# Altium project TrackerController010.PrjPcb
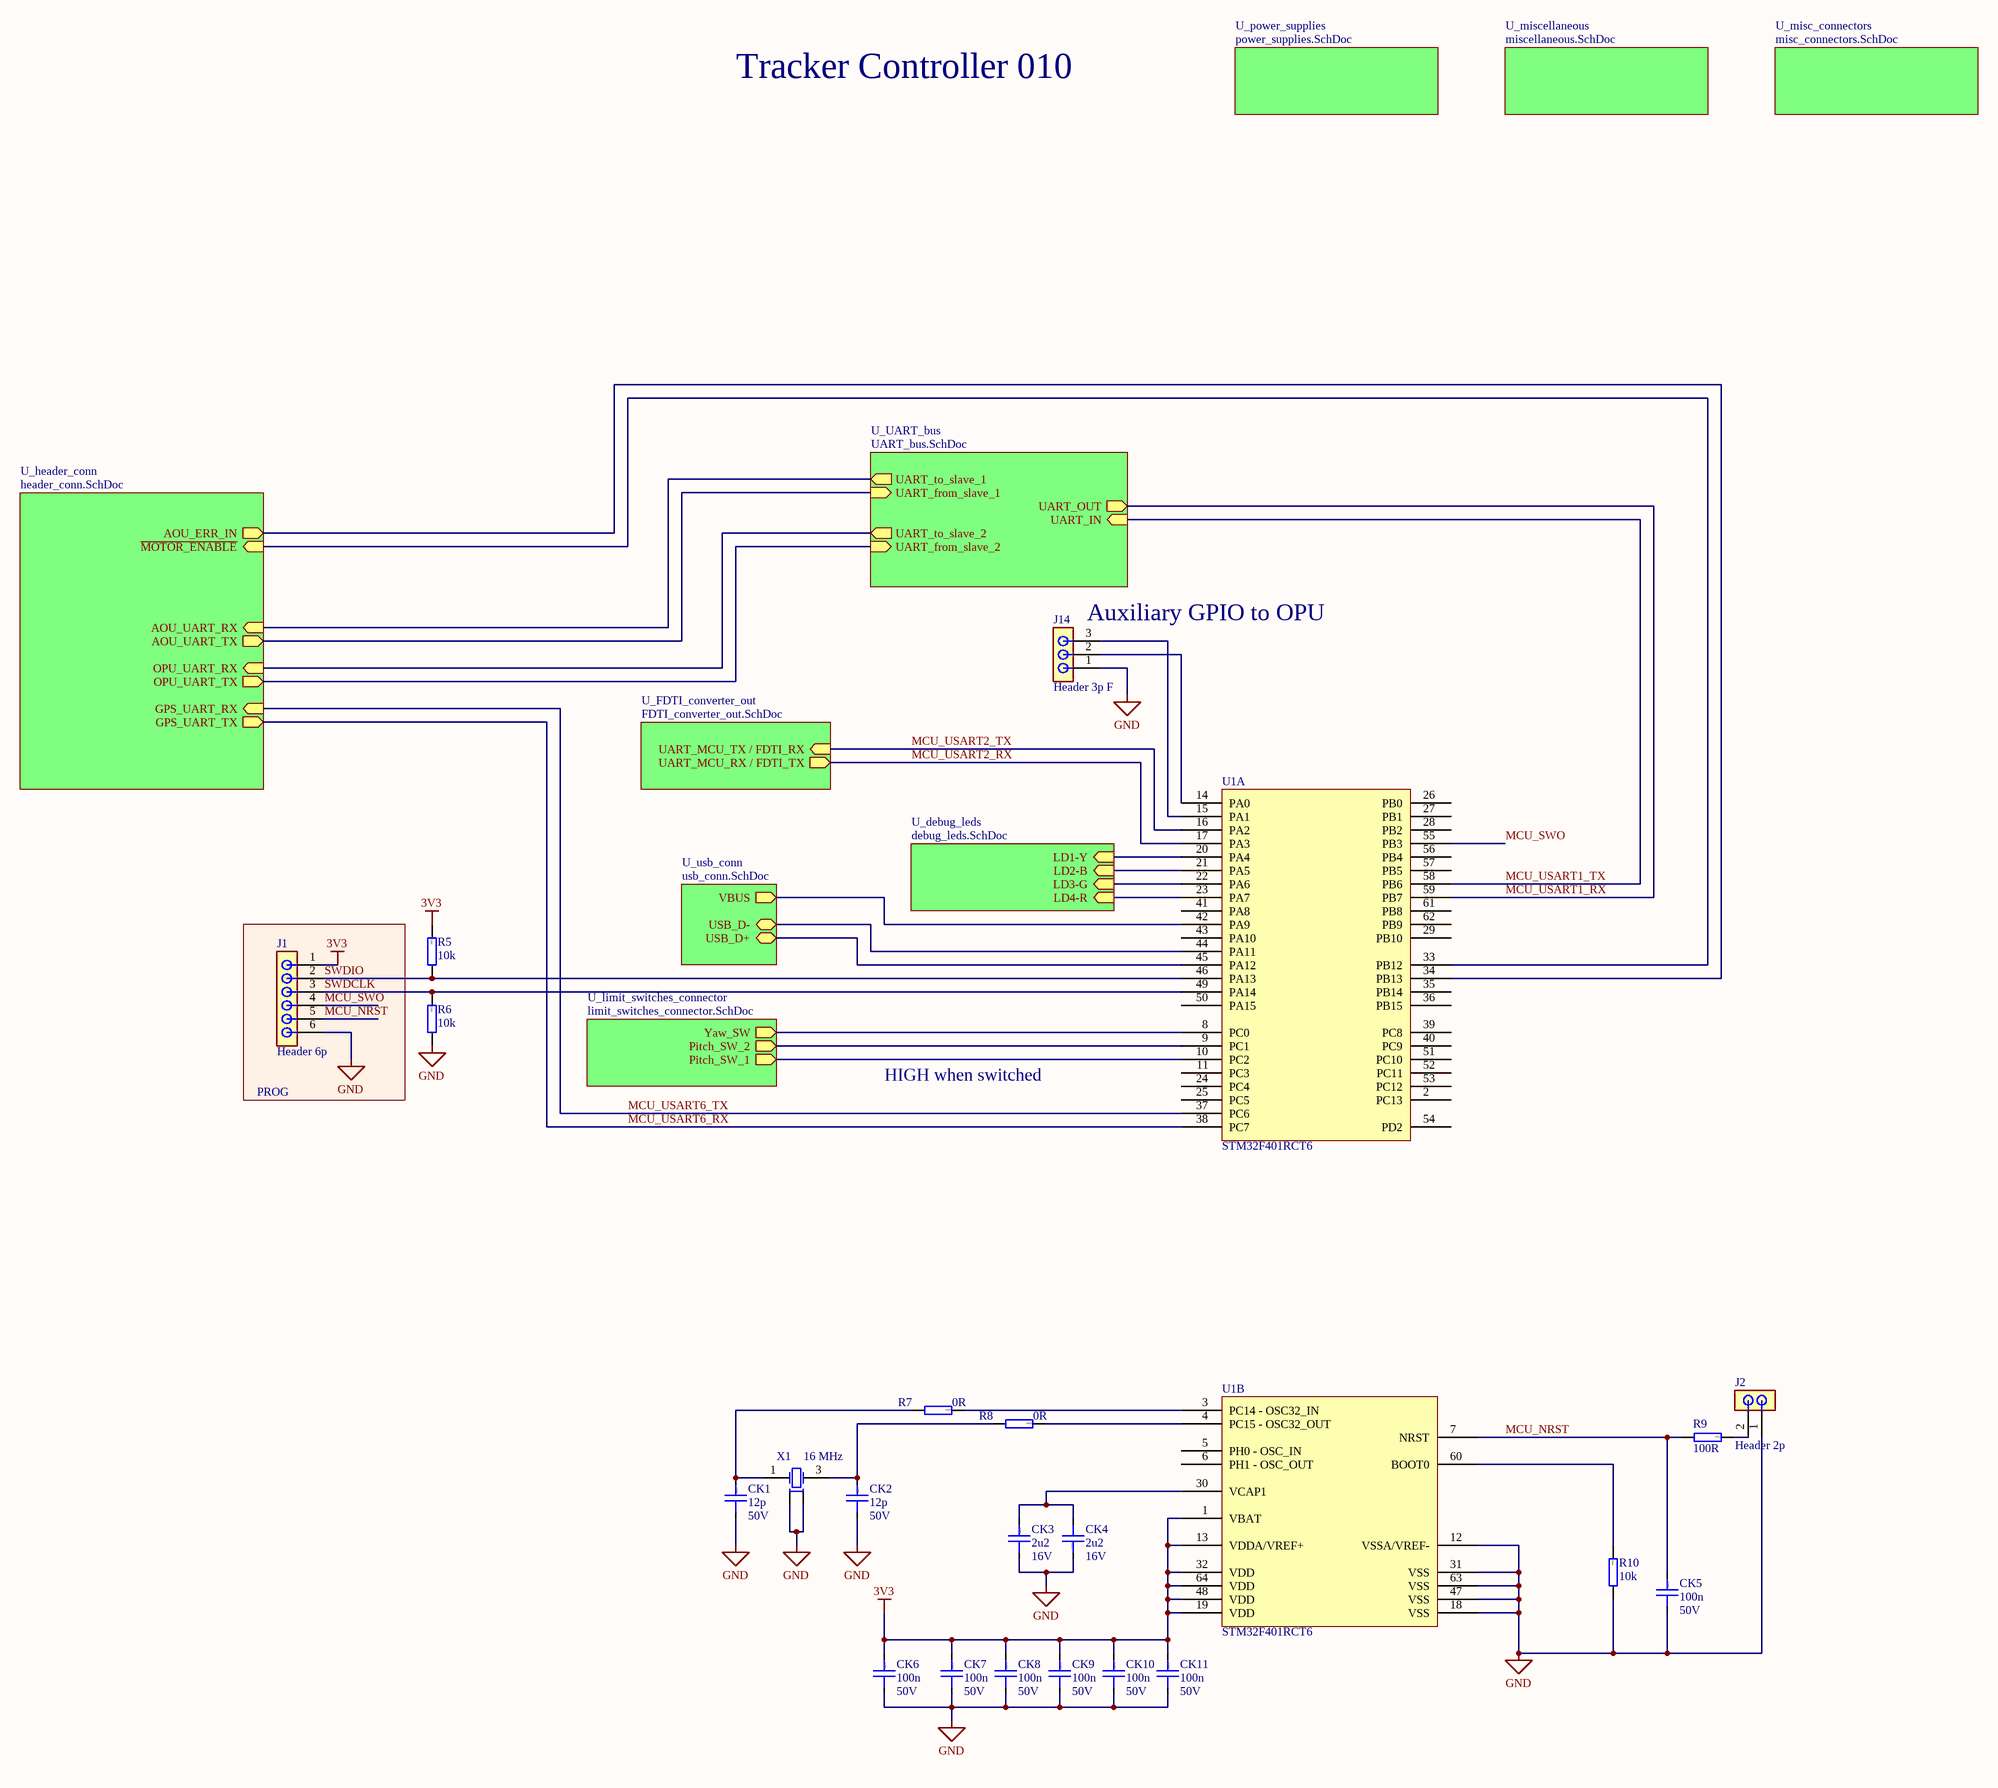
[diagram p0: main.SchDoc]
10 sheets, 125 parts. Net scope: hierarchical (ports join the sheet entries above them; power ports are global).
Board file: TrackerController010.PcbDoc
Sheets:
  main.SchDoc
    U_usb_conn = usb_conn.SchDoc
    U_FDTI_converter_out = FDTI_converter_out.SchDoc
    U_power_supplies = power_supplies.SchDoc
    U_UART_bus = UART_bus.SchDoc
    U_header_conn = header_conn.SchDoc
    U_miscellaneous = miscellaneous.SchDoc
    U_limit_switches_connector = limit_switches_connector.SchDoc
    U_misc_connectors = misc_connectors.SchDoc
    U_debug_leds = debug_leds.SchDoc

## Sheet main.SchDoc
size A2; SheetNumber: 1; SheetTotal: 10

### Parts
CK1  12p  Voltage rating: 50V  [CAP0603]
CK2  12p  Voltage rating: 50V  [CAP0603]
CK3  2u2  Voltage rating: 16V  [CAP0603]
CK4  2u2  Voltage rating: 16V  [CAP0603]
CK5  100n  Voltage rating: 50V  [CAP0603]
CK6  100n  Voltage rating: 50V  [CAP0603]
CK7  100n  Voltage rating: 50V  [CAP0603]
CK8  100n  Voltage rating: 50V  [CAP0603]
CK9  100n  Voltage rating: 50V  [CAP0603]
CK10  100n  Voltage rating: 50V  [CAP0603]
CK11  100n  Voltage rating: 50V  [CAP0603]
J1  Header 6p  [Pin header 6p]
J2  Header 2p  [Pin header 2p]
J14  Header 3p F  [Pin header 3p - F]
R5  10k  [RESC2012X06N(SMR0805)]
R6  10k  [RESC2012X06N(SMR0805)]
R7  0R  [RESC2012X06N(SMR0805)]
R8  0R  [RESC2012X06N(SMR0805)]
R9  100R  [RESC2012X06N(SMR0805)]
R10  10k  [RESC2012X06N(SMR0805)]
U1  STM32F401RCT6  [LQFP64]  (parts A,B of 2)
X1  16 MHz  [3225 XTal]

### Blocks framed on the sheet
PROG: J1

### Sub-sheets
U_debug_leds = debug_leds.SchDoc: LD4-R (in), LD3-G (in), LD2-B (in), LD1-Y (in)
U_FDTI_converter_out = FDTI_converter_out.SchDoc: UART_MCU_TX / FDTI_RX (in), UART_MCU_RX / FDTI_TX (out)
U_header_conn = header_conn.SchDoc: ~{MOTOR_ENABLE} (in), AOU_ERR_IN (out), AOU_UART_RX (in), AOU_UART_TX (out), GPS_UART_RX (in), GPS_UART_TX (out), OPU_UART_RX (in), OPU_UART_TX (out)
U_limit_switches_connector = limit_switches_connector.SchDoc: Pitch_SW_1 (out), Yaw_SW (out), Pitch_SW_2 (out)
U_misc_connectors = misc_connectors.SchDoc: no entries
U_miscellaneous = miscellaneous.SchDoc: no entries
U_power_supplies = power_supplies.SchDoc: no entries
U_UART_bus = UART_bus.SchDoc: UART_IN (in), UART_OUT (out), UART_to_slave_1 (out), UART_from_slave_1 (in), UART_to_slave_2 (out), UART_from_slave_2 (in)
U_usb_conn = usb_conn.SchDoc: VBUS (out), USB_D- (bidir), USB_D+ (bidir)

### Nets
3V3: CK6.1 CK7.1 CK8.1 CK9.1 CK10.1 CK11.1 J1.1 R5.2 U1.1(VBAT) U1.13(VDDA/VREF+) U1.19(VDD) U1.32(VDD) U1.48(VDD) U1.64(VDD)
GND: CK1.2 CK2.2 CK3.2 CK4.1 CK5.2 CK6.2 CK7.2 CK8.2 CK9.2 CK10.2 CK11.2 J1.6 J2.1 J14.1 R6.1 R10.1 U1.12(VSSA/VREF-) U1.18(VSS) U1.31(VSS) U1.47(VSS) U1.63(VSS) X1.2 X1.4
MCU_NRST: CK5.1 J1.5 R9.1 U1.7(NRST)
MCU_SWO: J1.4 U1.55(PB3)
MCU_USART1_RX: U1.59(PB7) ; sheet U_UART_bus/UART_OUT
MCU_USART1_TX: U1.58(PB6) ; sheet U_UART_bus/UART_IN
MCU_USART2_RX: U1.17(PA3) ; sheet U_FDTI_converter_out/UART_MCU_RX / FDTI_TX
MCU_USART2_TX: U1.16(PA2) ; sheet U_FDTI_converter_out/UART_MCU_TX / FDTI_RX
MCU_USART6_RX: U1.38(PC7) ; sheet U_header_conn/GPS_UART_TX  [project net GPS_UART_TX]
MCU_USART6_TX: U1.37(PC6) ; sheet U_header_conn/GPS_UART_RX  [project net GPS_UART_RX]
OPU_UART_RX: sheet U_UART_bus/UART_to_slave_2, sheet U_header_conn/OPU_UART_RX
OPU_UART_TX: sheet U_UART_bus/UART_from_slave_2, sheet U_header_conn/OPU_UART_TX
SWDCLK: J1.3 R6.2 U1.49(PA14)
SWDIO: J1.2 R5.1 U1.46(PA13)
NetCK1_1: CK1.1 R7.1 X1.1
NetCK2_1: CK2.1 R8.1 X1.3
NetCK3_1: CK3.1 CK4.2 U1.30(VCAP1)
NetCK30_1: U1.10(PC2) ; sheet U_limit_switches_connector/Pitch_SW_1
NetCK31_1: U1.9(PC1) ; sheet U_limit_switches_connector/Pitch_SW_2
NetCK32_1: U1.8(PC0) ; sheet U_limit_switches_connector/Yaw_SW
NetJ2_2: J2.2 R9.2
NetJ14_2: J14.2 U1.14(PA0)
NetJ14_3: J14.3 U1.15(PA1)
NetR1_1: U1.20(PA4) ; sheet U_debug_leds/LD1-Y
NetR2_1: U1.21(PA5) ; sheet U_debug_leds/LD2-B
NetR3_1: U1.22(PA6) ; sheet U_debug_leds/LD3-G
NetR4_1: U1.23(PA7) ; sheet U_debug_leds/LD4-R
NetR7_2: R7.2 U1.3(PC14_-_OSC32_IN)
NetR8_2: R8.2 U1.4(PC15_-_OSC32_OUT)
NetR10_2: R10.2 U1.60(BOOT0)
NetR11_1: U1.42(PA9) ; sheet U_usb_conn/VBUS
NetR13_2: U1.44(PA11) ; sheet U_usb_conn/USB_D-
NetR14_2: U1.45(PA12) ; sheet U_usb_conn/USB_D+
NetR27_2: sheet U_UART_bus/UART_to_slave_1, sheet U_header_conn/AOU_UART_RX
NetR29_2: U1.33(PB12) ; sheet U_header_conn/~{MOTOR_ENABLE}
NetR30_2: U1.34(PB13) ; sheet U_header_conn/AOU_ERR_IN
NetR32_2: sheet U_UART_bus/UART_from_slave_1, sheet U_header_conn/AOU_UART_TX

Not connected (* = marked no-connect by the designer): U1 2(PC13) 5(PH0_-_OSC_IN) 6(PH1_-_OSC_OUT) 11(PC3) 24(PC4) 25(PC5) 26(PB0) 27(PB1) 28(PB2) 29(PB10) 35(PB14) 36(PB15) 39(PC8) 40(PC9) 41(PA8) 43(PA10) 50(PA15) 51(PC10) 52(PC11) 53(PC12) 54(PD2) 56(PB4) 57(PB5) 61(PB8) 62(PB9)

### Notes on the sheet
- Tracker Controller 010
- (near J14) Auxiliary GPIO to OPU
- HIGH when switched
- (in symbol Cap 2u2 0603) 0603
- (in symbol Cap 12p 0603) 0603
- (in symbol Cap 100n 0603) 0603

### Library data of the parts
CK1 CK2 = Cap 12p 0603: 50V 12pF C0G ±5% 0603 Multilayer Ceramic Capacitors MLCC - SMD/SMT ROHS; Basic: Yes; Value: 12p; JLCPCB Part: C38523
CK3 CK4 = Cap 2u2 0603: 16V 2.2uF X5R ±10% 0603 Multilayer Ceramic Capacitors MLCC - SMD/SMT ROHS; Basic: Yes; Value: 2u2; JLCPCB Part: C23630
CK5-CK11 = Cap 100n 0603: 50V 100nF X7R ±10% 0603 Multilayer Ceramic Capacitors MLCC - SMD/SMT ROHS; Basic: Yes; Value: 100n; JLCPCB Part: C14663
J1 = Pin header 6p: 3A Direct Insert Policy 6P -40℃~+105℃ 2.54mm Single Row Black Brass 1x6P Plugin,P=2.54mm Pin Headers ROHS; Manufacturer_Name: Connfly; Manufacturer_Part_Number: DS1021-1*2SF11-B; Datasheet Link: https://www.tme.com/Document/cc301e58a5da78cb543a94b5a5b7f06a/DS1021.pdf; Height: 5.88mm; JLCPCB Part: C37208
J2 = Pin header 2p: Connector; Manufacturer_Name: Connfly; Manufacturer_Part_Number: DS1021-1*2SF11-B; Basic: No; Datasheet Link: https://www.tme.com/Document/cc301e58a5da78cb543a94b5a5b7f06a/DS1021.pdf; Height: 5.88mm; JLCPCB Part: C492401
J14 = Pin header 3p_F: Direct Insert 2.54mm Policy 3A 2.5mm -40℃~+105℃ 3mm 6mm 250V Black 1x3P Single Row 3P Pin Headers; Manufacturer_Name: Connfly; Manufacturer_Part_Number: DS1021-1*2SF11-B; Basic: No; Datasheet Link: https://www.tme.com/Document/cc301e58a5da78cb543a94b5a5b7f06a/DS1021.pdf; Height: 5.88mm
R5 R6 R10 = Res 10k 0805: 125mW Thick Film Resistors 150V ±100ppm/℃ ±1% 10kΩ 0805 Chip Resistor - Surface Mount ROHS; Tolerance & Rating: 1%/0.1W; Basic: Yes; Value: 10k; Package: 0805; SMD: 1; ComponentLink3Description: rezistor čip; ComponentLink3URL: heliosgreen://v1/hegMT/5-MT/Classes(343)/Folders/OpenForm?RecordNumbers=[381513]; JLCPCB Part: C17414
R7 R8 = Res 0R 0805: 125mW Thick Film Resistors 150V ±800ppm/℃ ±1% 0Ω 0805 Chip Resistor - Surface Mount ROHS; Tolerance & Rating: 1%/0.1W; Basic: YES; Value: 0R; Package: 0805; Author: JP/27.03.2014; SMD: 1; ComponentLink3Description: rezistor čip; ComponentLink3URL: heliosgreen://v1/hegMT/5-MT/Classes(343)/Folders/OpenForm?RecordNumbers=[381513]; JLCPCB Part: C17477
R9 = Res 100R 0805: 125mW Thick Film Resistors 150V ±100ppm/℃ ±1% 100Ω 0805 Chip Resistor - Surface Mount ROHS; Tolerance & Rating: 1%/0.1W; Basic: Yes; Value: 100R; Package: 0805; Author: JP/27.03.2014; SMD: 1; ComponentLink3Description: rezistor čip; ComponentLink3URL: heliosgreen://v1/hegMT/5-MT/Classes(343)/Folders/OpenForm?RecordNumbers=[381513]; JLCPCB Part: C17408
U1 = STM32F401RCT6: 256KB 1.7V~3.6V ARM-M4 64KB 84MHz FLASH 50 LQFP-64(10x10) Microcontrollers (MCU/MPU/SOC) ROHS; Basic: No; JLCPCB Part: C74524
X1 = 16 MHz crystal: X322516MLB4SI / 16MHz Surface Mount Crystal 9pF ±10ppm ±20ppm SMD3225-4P Crystals ROHS; Basic: Yes; JLCPCB: C13738

## Sheet usb_conn.SchDoc
size A4; SheetNumber: 2; SheetTotal: 10
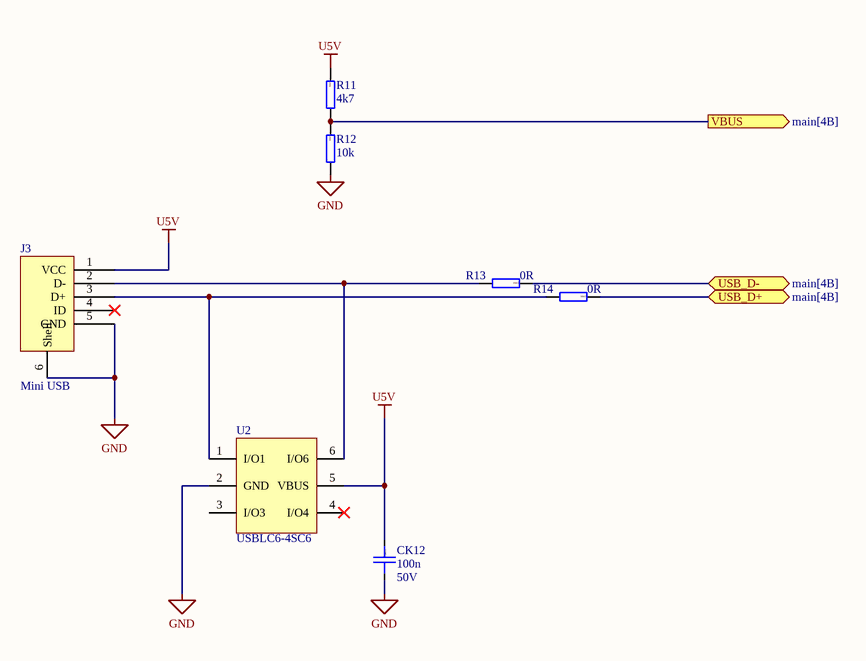
[diagram p1: usb_conn.SchDoc]

### Parts
CK12  100n  Voltage rating: 50V  [CAP0603]
J3  Mini USB  [USB B Mini horizontal]
R11  4k7  [RESC2012X06N(SMR0805)]
R12  10k  [RESC2012X06N(SMR0805)]
R13  0R  [RESC2012X06N(SMR0805)]
R14  0R  [RESC2012X06N(SMR0805)]
U2  USBLC6-4SC6  [SOT23-6]

### Ports
USB_D+ (bidir, see main[4B]), USB_D- (bidir, see main[4B]), VBUS (out, see main[4B])

### Nets
GND: CK12.2 J3.5(GND) J3.6(Shell) R12.1 U2.2(GND)
U5V: CK12.1 J3.1(VCC) R11.2 U2.5(VBUS)
NetJ3_2: J3.2(D-) R13.1 U2.6(I/O6)
NetJ3_3: J3.3(D+) R14.1 U2.1(I/O1)
NetR11_1: R11.1 R12.2 ; port VBUS
NetR13_2: R13.2 ; port USB_D-
NetR14_2: R14.2 ; port USB_D+

Not connected (* = marked no-connect by the designer): J3 4(ID)*; U2 3(I/O3) 4(I/O4)*

### Notes on the sheet
- (in symbol Cap 100n 0603) 0603

### Library data of the parts
CK12 = Cap 100n 0603: as CK5 on sheet main; Value: 100n; JLCPCB Part: C14663
J3 = Mini USB: Konektor: USB B mini; zásuvka; na PCB; SMT; PIN: 5; vodorovné; TME Part: MX-67503-1020
R11 = Res 4k7 0805: 125mW Thick Film Resistors 150V ±100ppm/℃ ±1% 4.7kΩ 0805 Chip Resistor - Surface Mount ROHS; Tolerance & Rating: 1%/0.1W; Basic: YES; Value: 4k7; Package: 0805; Author: JP/27.03.2014; SMD: 1; ComponentLink3Description: rezistor čip; ComponentLink3URL: heliosgreen://v1/hegMT/5-MT/Classes(343)/Folders/OpenForm?RecordNumbers=[381513]; JLCPCB Part: C17673
R12 = Res 10k 0805: as R5 on sheet main; Value: 10k; Package: 0805; SMD: 1; ComponentLink3Description: rezistor čip; ComponentLink3URL: heliosgreen://v1/hegMT/5-MT/Classes(343)/Folders/OpenForm?RecordNumbers=[381513]; JLCPCB Part: C17414
R13 R14 = Res 0R 0805: as R7 on sheet main; Value: 0R; Package: 0805; Author: JP/27.03.2014; SMD: 1; ComponentLink3Description: rezistor čip; ComponentLink3URL: heliosgreen://v1/hegMT/5-MT/Classes(343)/Folders/OpenForm?RecordNumbers=[381513]; JLCPCB Part: C17477
U2 = USBLC6-4SC6: 5A 17V 6V Unidirectional 5.25V SOT-23-6 ESD and Surge Protection (TVS/ESD) ROHS; Basic: No; JLCPCB Part: C111212; TME Part: USBLC6-4SC6

## Sheet FDTI_converter_out.SchDoc
size A4; SheetNumber: 3; SheetTotal: 10
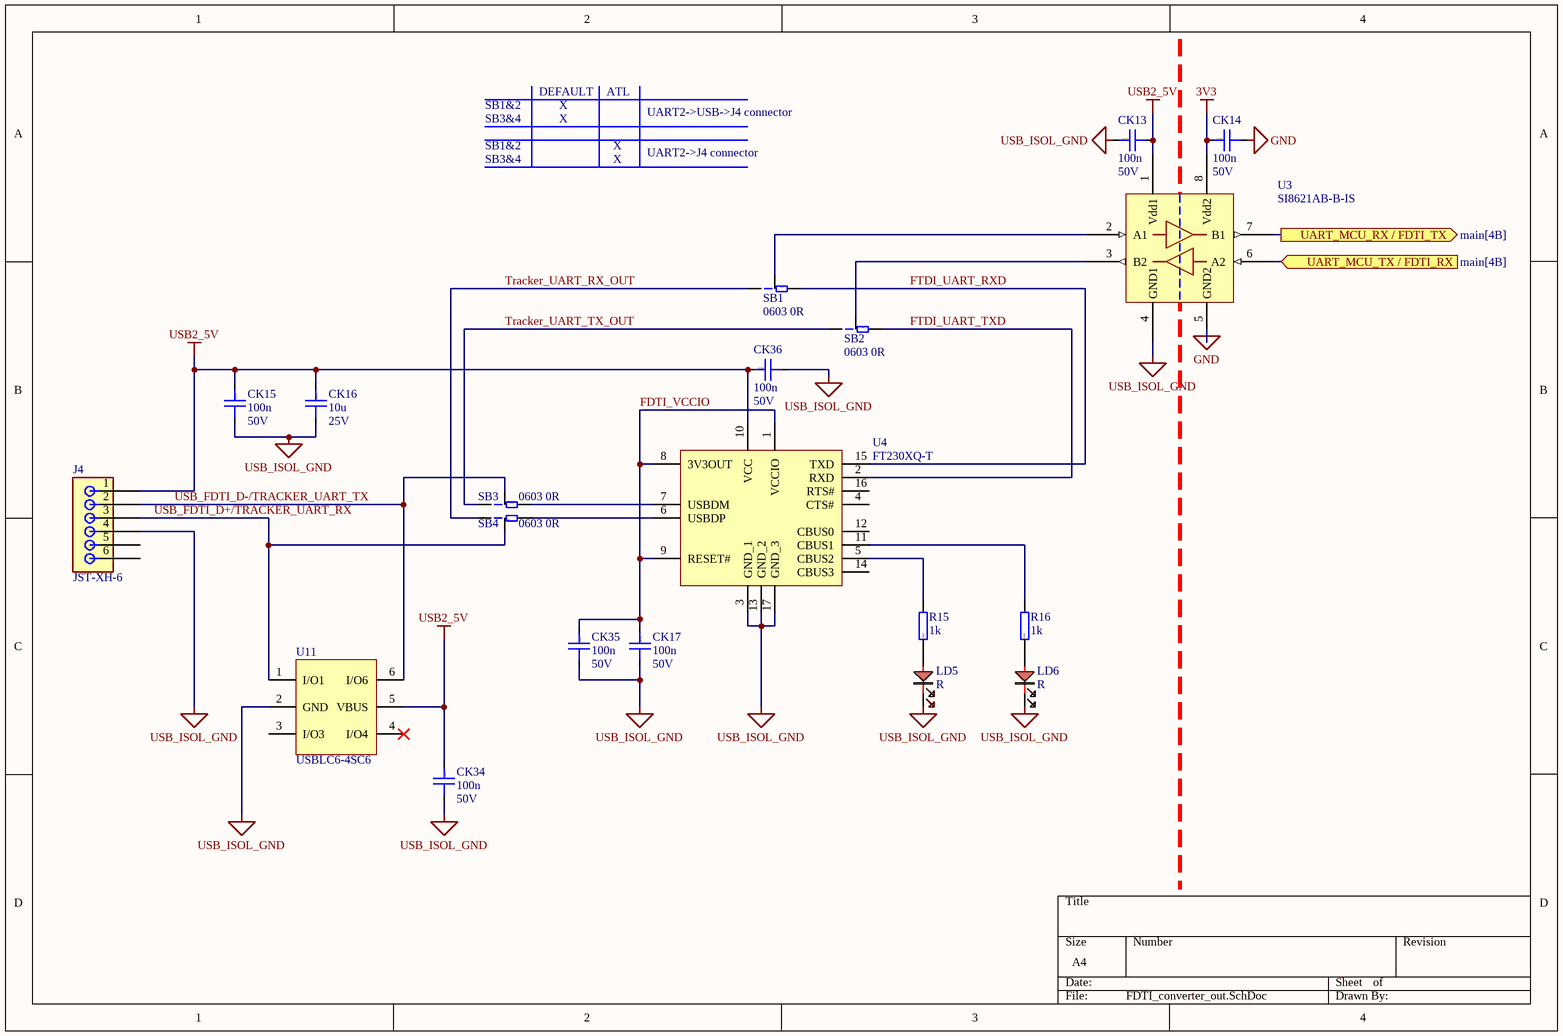
[diagram p2: FDTI_converter_out.SchDoc]

### Parts
CK13  100n  Voltage rating: 50V  [CAP0603]
CK14  100n  Voltage rating: 50V  [CAP0603]
CK15  100n  Voltage rating: 50V  [CAP0603]
CK16  10u  Voltage rating: 25V  [CAP0805]
CK17  100n  Voltage rating: 50V  [CAP0603]
CK34  100n  Voltage rating: 50V  [CAP0603]
CK35  100n  Voltage rating: 50V  [CAP0603]
CK36  100n  Voltage rating: 50V  [CAP0603]
J4  JST-XH-6  [JST-XH-6]
LD5  R  [0603_LED_R]
LD6  R  [0603_LED_R]
R15  1k  [RESC2012X06N(SMR0805)]
R16  1k  [RESC2012X06N(SMR0805)]
SB1  0603 0R  [Solder T bridge 0603]
SB2  0603 0R  [Solder T bridge 0603]
SB3  0603 0R  [Solder T bridge 0603]
SB4  0603 0R  [Solder T bridge 0603]
U3  SI8621AB-B-IS  [SOIC8]
U4  FT230XQ-T  [QFN65P400X400X80-17N]
U11  USBLC6-4SC6  [SOT23-6]

### Ports
UART_MCU_RX / FDTI_TX (out, see main[4B]), UART_MCU_TX / FDTI_RX (in, see main[4B])

### Nets
3V3: CK14.1 U3.8(Vdd2)
GND: CK14.2 U3.5(GND2)
USB2_5V: CK13.2 CK15.1 CK16.1 CK34.1 CK36.1 J4.1 U3.1(Vdd1) U4.10(VCC) U11.5(VBUS)
USB_ISOL_GND: CK13.1 CK15.2 CK16.2 CK17.2 CK34.2 CK35.2 CK36.2 J4.4 LD5.2 LD6.2 U3.4(GND1) U4.3(GND_1) U4.13(GND_2) U4.17(GND_3) U11.2(GND)
FDTI_VCCIO: CK17.1 CK35.1 U4.1(VCCIO) U4.8(3V3OUT) U4.9(RESET#)
FTDI_UART_RXD: SB1.3 U4.15(TXD)
FTDI_UART_TXD: SB2.3 U4.2(RXD)
MCU_USART2_RX: U3.7(B1) ; port UART_MCU_RX / FDTI_TX
MCU_USART2_TX: U3.6(A2) ; port UART_MCU_TX / FDTI_RX
Tracker_UART_RX_OUT: SB1.1 SB4.1
Tracker_UART_TX_OUT: SB2.1 SB3.1
USB_FDTI_D+/TRACKER_UART_RX: J4.3 SB4.2 U11.1(I/O1)
USB_FDTI_D-/TRACKER_UART_TX: J4.2 SB3.2 U11.6(I/O6)
NetLD5_1: LD5.1 R15.2
NetLD6_1: LD6.1 R16.2
NetR15_1: R15.1 U4.5(CBUS2)
NetR16_1: R16.1 U4.11(CBUS1)
NetSB1_2: SB1.2 U3.2(A1)
NetSB2_2: SB2.2 U3.3(B2)
NetSB3_3: SB3.3 U4.7(USBDM)
NetSB4_3: SB4.3 U4.6(USBDP)

Not connected (* = marked no-connect by the designer): J4 5 6; U4 4(CTS#) 12(CBUS0) 14(CBUS3) 16(RTS#); U11 3(I/O3) 4(I/O4)*

### Notes on the sheet
- SB1&2
- DEFAULT
- X
- ATL
- UART2->USB->J4 connector
- SB3&4
- UART2->J4 connector
- (in symbol 0R T-junction) 0R
- (in symbol Cap 10u 0805) 0805
- (in symbol Cap 100n 50V 0603) 0603
- (in symbol Cap 100n 0603) 0603

### Library data of the parts
CK13-CK15 CK17 CK35 CK36 = Cap 100n 50V 0603: 50V 100nF X7R ±10% 0603 Multilayer Ceramic Capacitors MLCC - SMD/SMT ROHS; Basic: Yes; Value: 100n; JLCPCB Part: C14663
CK16 = Cap 10u 0805: 25V 10uF X5R ±10% 0805 Multilayer Ceramic Capacitors MLCC - SMD/SMT ROHS; Basic: Yes; JLCPCB Part: C15850; Value: 10u
CK34 = Cap 100n 0603: as CK5 on sheet main; Value: 100n; JLCPCB Part: C14663
J4 = JST-HX-6: 1x6P 6P XH Tin 6 -25℃~+85℃ 3A 1 2.5mm Brass Bend insert Push-Pull,P=2.5mm Wire To Board Connector ROHS; S6B-XH-A(LF)(SN); Basic: No; JLCPCB Part: C157919; TME Part: S6B-XH-A
LD5 LD6 = LED R 0603: -40℃~+85℃ Red 0603 LED Indication - Discrete ROHS; JLCPCB Part: C2286
R15 R16 = Res 1k 0805: 125mW Thick Film Resistors 150V ±100ppm/℃ ±1% 1kΩ 0805 Chip Resistor - Surface Mount ROHS; Tolerance & Rating: 1%/0.1W; Basic: Yes; Value: 1k; Package: 0805; Author: JP/27.03.2014; SMD: 1; ComponentLink3Description: rezistor čip; ComponentLink3URL: heliosgreen://v1/hegMT/5-MT/Classes(343)/Folders/OpenForm?RecordNumbers=[381513]; JLCPCB Part: C17513
SB1-SB4 = 0R T-junction: Basic: Yes; JLCPCB Part: C21189
U3 = SI8621AB-B-IS: SOIC-8 Digital Isolators ROHS; Basic: No; JLCPCB Part: C430265; TME Part: SI8621AB-B-IS
U4 = FT230XQ-T: Integrated Circuit; Manufacturer_Name: FTDI Chip; Basic: No; Datasheet Link: https://www.ftdichip.com/Support/Documents/DataSheets/ICs/DS_FT230X.pdf; Height: 0.8mm; Manufacturer_Part_Number: FT230XQ-T; Mouser Part Number: 895-FT230XQ-T; Mouser Price/Stock: https://www.mouser.co.uk/ProductDetail/FTDI/FT230XQ-T?qs=Gp1Yz1mis3UQjzUa74hRVg%3D%3D; Arrow Part Number: FT230XQ-T; Arrow Price/Stock: https://www.arrow.com/en/products/ft230xq-t/ftdi-chip?region=europe; JLCPCB Part: C3216402; TME Part: FT230XQ-T
U11 = USBLC6-4SC6: as U2 on sheet usb_conn; JLCPCB Part: C111212; TME Part: USBLC6-4SC6

## Sheet power_supplies.SchDoc
size A4; SheetNumber: 4; SheetTotal: 10
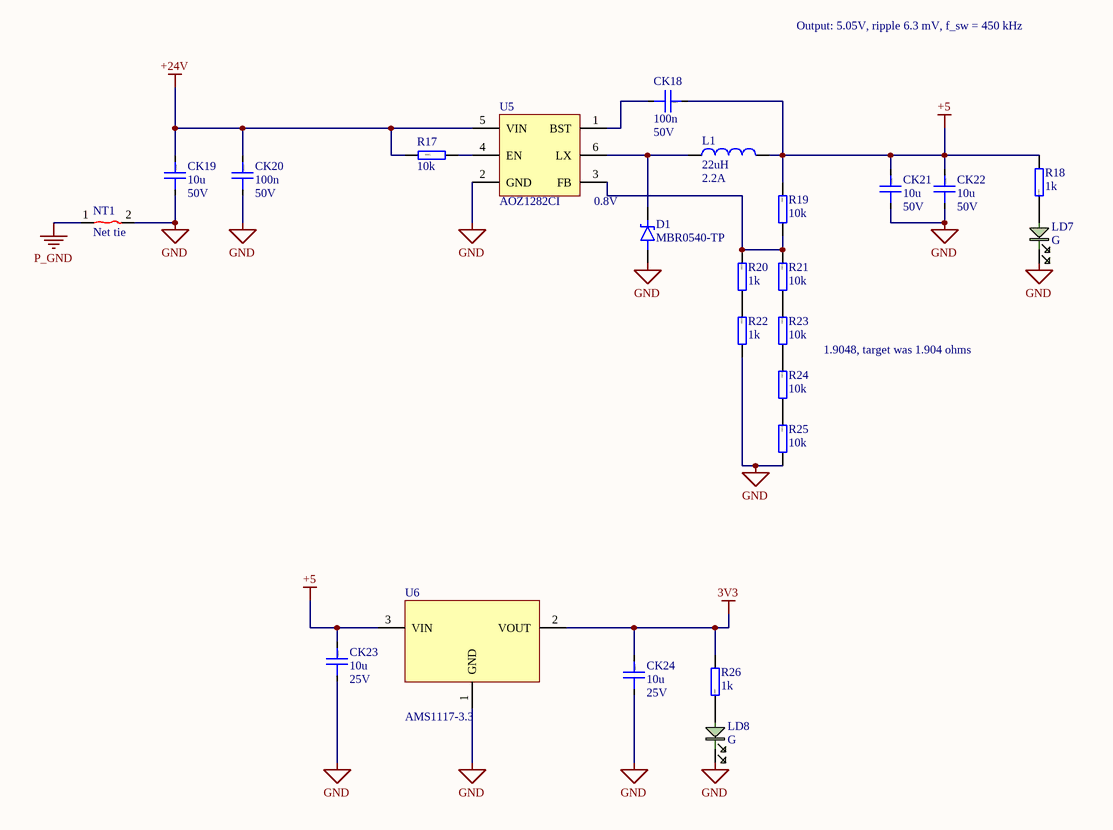
[diagram p3: power_supplies.SchDoc]

### Parts
CK18  100n  Voltage rating: 50V  [CAP0603]
CK19  10u  Voltage rating: 50V  [CAP1206]
CK20  100n  Voltage rating: 50V  [CAP0603]
CK21  10u  Voltage rating: 50V  [CAP1206]
CK22  10u  Voltage rating: 50V  [CAP1206]
CK23  10u  Voltage rating: 25V  [CAP0805]
CK24  10u  Voltage rating: 25V  [CAP0805]
D1  MBR0540-TP  [SOD3716X135N]
L1  22uH  Current: 2.2A  [ETQP3M_KVN]
LD7  G  [0603_LED_G]
LD8  G  [0603_LED_G]
NT1  Net tie  [Net tie]  (net tie, no BOM)
R17  10k  [RESC2012X06N(SMR0805)]
R18  1k  [RESC2012X06N(SMR0805)]
R19  10k  [RESC2012X06N(SMR0805)]
R20  1k  [RESC2012X06N(SMR0805)]
R21  10k  [RESC2012X06N(SMR0805)]
R22  1k  [RESC2012X06N(SMR0805)]
R23  10k  [RESC2012X06N(SMR0805)]
R24  10k  [RESC2012X06N(SMR0805)]
R25  10k  [RESC2012X06N(SMR0805)]
R26  1k  [RESC2012X06N(SMR0805)]
U5  AOZ1282CI  [SOT23-6]
U6  AMS1117-3.3  [SOT230P700X180-4M]

### Nets
3V3: CK24.1 R26.1 U6.2(VOUT)
+5: CK18.1 CK21.1 CK22.1 CK23.1 L1.2 R18.1 R19.2 U6.3(VIN)
+24V: CK19.1 CK20.1 R17.2 U5.5(VIN)
GND: CK19.2 CK20.2 CK21.2 CK22.2 CK23.2 CK24.2 D1.2(A) LD7.2 LD8.2 NT1.2 R22.1 R25.1 U5.2(GND) U6.1(GND)
P_GND: NT1.1
NetCK18_2: CK18.2 U5.1(BST)
NetD1_1: D1.1(K) L1.1 U5.6(LX)
NetLD7_1: LD7.1 R18.2
NetLD8_1: LD8.1 R26.2
NetR17_1: R17.1 U5.4(EN)
NetR19_1: R19.1 R20.2 R21.2 U5.3(FB)
NetR20_1: R20.1 R22.2
NetR21_1: R21.1 R23.2
NetR23_1: R23.1 R24.2
NetR24_1: R24.1 R25.2

### Notes on the sheet
- Output: 5.05V, ripple 6.3 mV, f_sw = 450 kHz
- 0.8V
- 1.9048, target was 1.904 ohms
- (in symbol Cap 10u 50V 1206) 1206
- (in symbol Cap 10u 0805) 0805
- (in symbol Cap 100n 50V 0603) 0603

### Library data of the parts
CK18 CK20 = Cap 100n 50V 0603: as CK13 on sheet FDTI_converter_out; Value: 100n; JLCPCB Part: C14663
CK19 CK21 CK22 = Cap 10u 50V 1206: 50V 10uF X5R ±10% 1206 Multilayer Ceramic Capacitors MLCC - SMD/SMT ROHS; Basic: Yes; JLCPCB Part: C13585; Value: 10u
CK23 CK24 = Cap 10u 0805: as CK16 on sheet FDTI_converter_out; JLCPCB Part: C15850; Value: 10u
D1 = Diode Schottky MBR0540-TP: Diode 40 V 500mA Surface Mount SOD-123; Manufacturer_Name: MCC; Basic: No; Datasheet Link: https://mccsemi.com/pdf/Products/MBR0520-MBR0580(SOD123).pdf; Height: 1.35mm; Manufacturer_Part_Number: MBR0540-TP; Mouser Part Number: 833-MBR0540-TP; Mouser Price/Stock: https://www.mouser.co.uk/ProductDetail/Micro-Commercial-Components-MCC/MBR0540-TP?qs=Vo7e0yZOYdEH3ZK7VsaoCA%3D%3D; Arrow Part Number: MBR0540-TP; Arrow Price/Stock: https://www.arrow.com/en/products/mbr0540-tp/micro-commercial-components?region=nac; JLCPCB Part: C78744; TME Part: MBR0540-TP
L1 = Ind 22uH 2.2A: 2.2A 22uH Integrated molded inductor ±20% SMD,6.4x6mm Power Inductors ROHS; Basic: No; Published: 1-Apr-2025; Publisher: Altium Limited; Value: 22uH; JLCPCB Part: C412305; TME Part: ETQP3M220KVN
LD7 LD8 = LED G 0603: 0603 Green Led; JLCPCB Part: C22371297
R17 R19 R21 R23-R25 = Res 10k 0805: as R5 on sheet main; Value: 10k; Package: 0805; SMD: 1; ComponentLink3Description: rezistor čip; ComponentLink3URL: heliosgreen://v1/hegMT/5-MT/Classes(343)/Folders/OpenForm?RecordNumbers=[381513]; JLCPCB Part: C17414
R18 R20 R22 R26 = Res 1k 0805: as R15 on sheet FDTI_converter_out; Value: 1k; Package: 0805; Author: JP/27.03.2014; SMD: 1; ComponentLink3Description: rezistor čip; ComponentLink3URL: heliosgreen://v1/hegMT/5-MT/Classes(343)/Folders/OpenForm?RecordNumbers=[381513]; JLCPCB Part: C17513
U5 = AOZ1282CI: Step-down type Adjustable 800mV~36V 1.2A 4.5V~36V SOT-23-6 DC-DC Converters ROHS; Manufacturer_Name: Alpha & Omega Semiconductors; Basic: No; Datasheet Link: http://www.aosmd.com/res/data_sheets/AOZ1282CI.pdf; Height: 1.25mm; Manufacturer_Part_Number: AOZ1282CI; Arrow Part Number: AOZ1282CI; Arrow Price/Stock: https://www.arrow.com/en/products/aoz1282ci/alpha-and-omega-semiconductor?region=nac; JLCPCB Part: C111916; TME Part: AOZ1282CI
U6 = AMS1117-3.3: 72dB@(120Hz) 1A Fixed 3.3V Positive electrode SOT-223 Voltage Regulators - Linear, Low Drop Out (LDO) Regulators ROHS; Basic: Yes; JLCPCB Part: C6186

## Sheet UART_bus.SchDoc
size A4; SheetNumber: 5; SheetTotal: 10
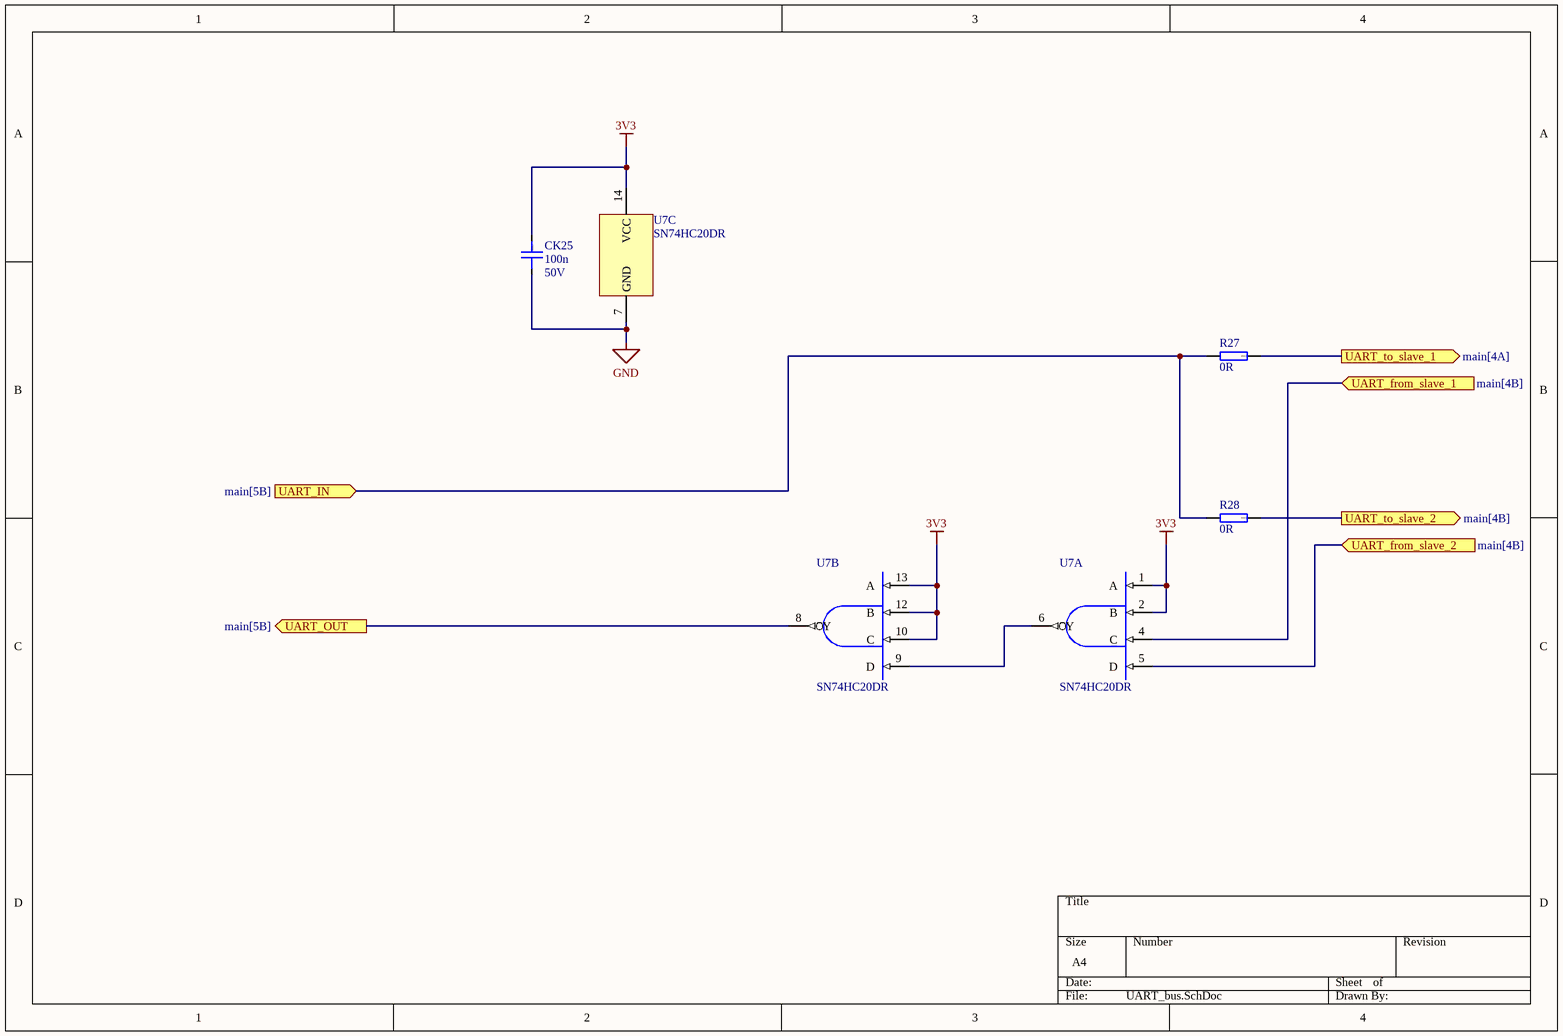
[diagram p4: UART_bus.SchDoc]

### Parts
CK25  100n  Voltage rating: 50V  [CAP0603]
R27  0R  [RESC2012X06N(SMR0805)]
R28  0R  [RESC2012X06N(SMR0805)]
U7  SN74HC20DR  [SOIC14]  (parts A,B,C of 3)

### Ports
UART_from_slave_1 (in, see main[4B]), UART_from_slave_2 (in, see main[4B]), UART_IN (in, see main[5B]), UART_OUT (out, see main[5B]), UART_to_slave_1 (out, see main[4A]), UART_to_slave_2 (out, see main[4B])

### Nets
3V3: CK25.1 U7.1(A) U7.2(B) U7.10(C) U7.12(B) U7.13(A) U7.14(VCC)
GND: CK25.2 U7.7(GND)
MCU_USART1_RX: U7.8(Y) ; port UART_OUT
MCU_USART1_TX: R27.1 R28.1 ; port UART_IN
OPU_UART_RX: R28.2 ; port UART_to_slave_2
OPU_UART_TX: U7.5(D) ; port UART_from_slave_2
NetR27_2: R27.2 ; port UART_to_slave_1
NetR32_2: U7.4(C) ; port UART_from_slave_1
NetU7_6: U7.6(Y) U7.9(D)

### Notes on the sheet
- (in symbol Cap 100n 0603) 0603

### Library data of the parts
CK25 = Cap 100n 0603: as CK5 on sheet main; Value: 100n; JLCPCB Part: C14663
R27 R28 = Res 0R 0805: as R7 on sheet main; Value: 0R; Package: 0805; Author: JP/27.03.2014; SMD: 1; ComponentLink3Description: rezistor čip; ComponentLink3URL: heliosgreen://v1/hegMT/5-MT/Classes(343)/Folders/OpenForm?RecordNumbers=[381513]; JLCPCB Part: C17477
U7 = SN74HC20DR: 2V~6V 2uA 2 19ns@6V,50pF NAND Gates SOIC-14 Logic Gates ROHS; Basic: No; JLCPCB Part: C2867684; TME Part: SN74HC20DR

## Sheet header_conn.SchDoc
size A4; SheetNumber: 6; SheetTotal: 10
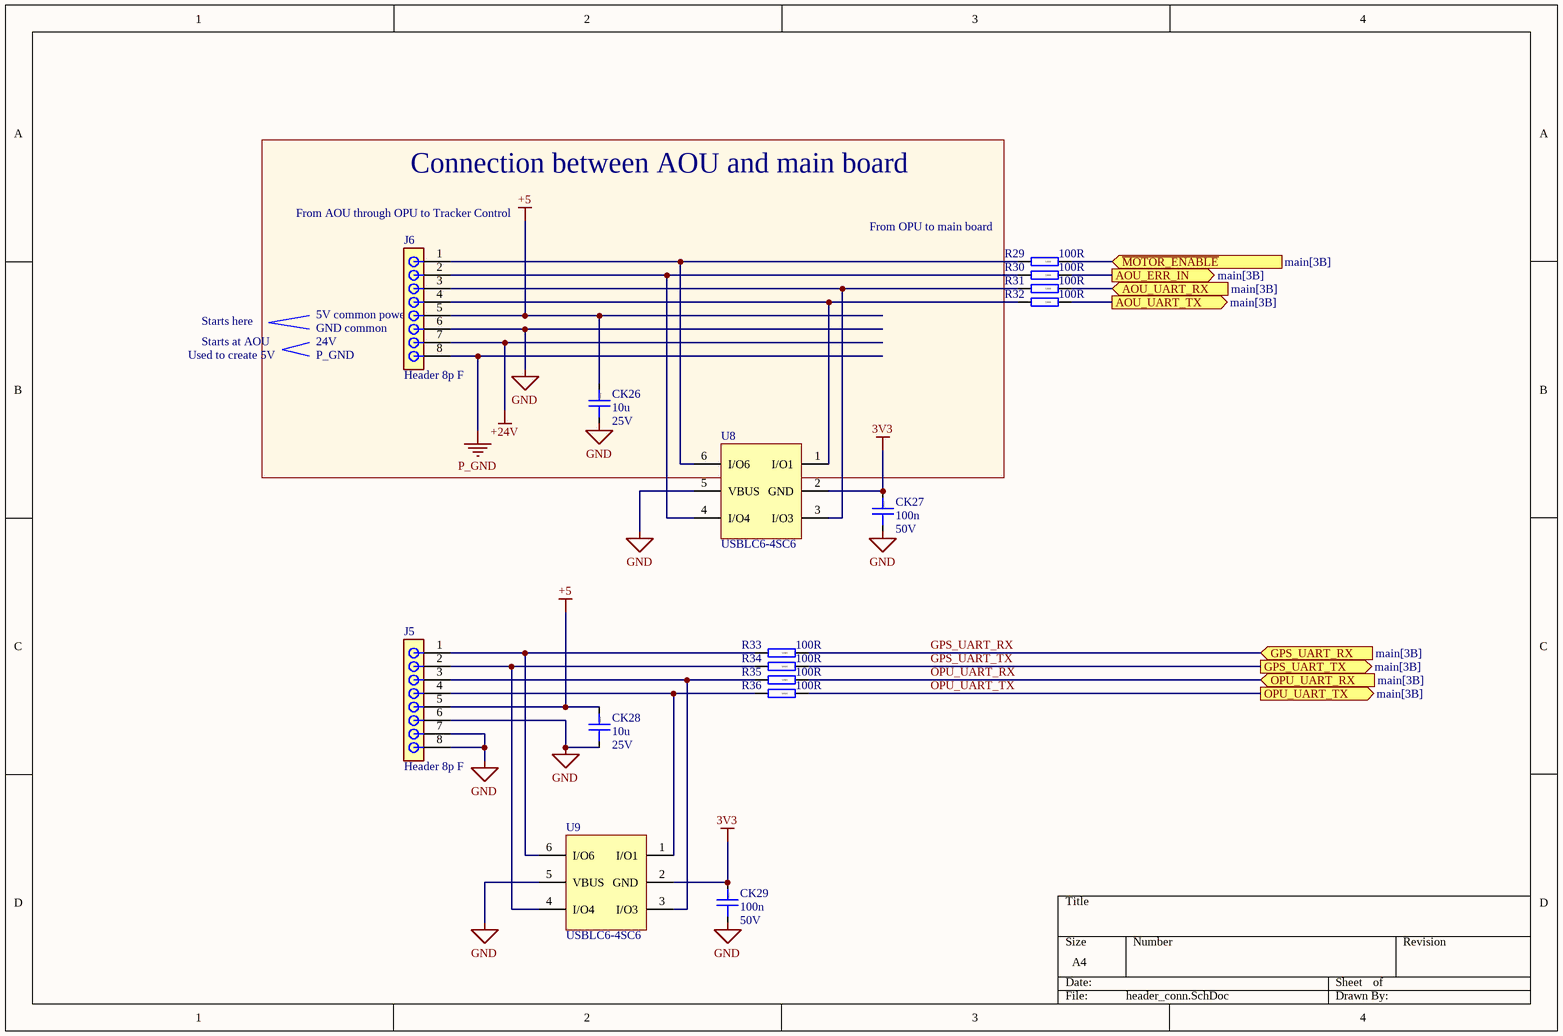
[diagram p5: header_conn.SchDoc]

### Parts
CK26  10u  Voltage rating: 25V  [CAP0805]
CK27  100n  Voltage rating: 50V  [CAP0603]
CK28  10u  Voltage rating: 25V  [CAP0805]
CK29  100n  Voltage rating: 50V  [CAP0603]
J5  Header 8p F  [Pin header 8p - F]
J6  Header 8p F  [Pin header 8p - F]
R29  100R  [RESC2012X06N(SMR0805)]
R30  100R  [RESC2012X06N(SMR0805)]
R31  100R  [RESC2012X06N(SMR0805)]
R32  100R  [RESC2012X06N(SMR0805)]
R33  100R  [RESC2012X06N(SMR0805)]
R34  100R  [RESC2012X06N(SMR0805)]
R35  100R  [RESC2012X06N(SMR0805)]
R36  100R  [RESC2012X06N(SMR0805)]
U8  USBLC6-4SC6  [SOT23-6]
U9  USBLC6-4SC6  [SOT23-6]

### Blocks framed on the sheet
Connection between AOU and main board: CK26 J6

### Ports
AOU_ERR_IN (out, see main[3B]), AOU_UART_RX (in, see main[3B]), AOU_UART_TX (out, see main[3B]), GPS_UART_RX (in, see main[3B]), GPS_UART_TX (out, see main[3B]), OPU_UART_RX (in, see main[3B]), OPU_UART_TX (out, see main[3B]), ~{MOTOR_ENABLE} (in, see main[3B])

### Nets
3V3: CK27.1 CK29.1 U8.2(GND) U9.2(GND)
+5: CK26.1 CK28.1 J5.5 J6.5
+24V: J6.7
GND: CK26.2 CK27.2 CK28.2 CK29.2 J5.6 J5.7 J5.8 J6.6 U8.5(VBUS) U9.5(VBUS)
P_GND: J6.8
GPS_UART_RX: R33.2 ; port GPS_UART_RX
GPS_UART_TX: R34.2 ; port GPS_UART_TX
OPU_UART_RX: R35.2 ; port OPU_UART_RX
OPU_UART_TX: R36.2 ; port OPU_UART_TX
NetJ5_1: J5.1 R33.1 U9.6(I/O6)
NetJ5_2: J5.2 R34.1 U9.4(I/O4)
NetJ5_3: J5.3 R35.1 U9.3(I/O3)
NetJ5_4: J5.4 R36.1 U9.1(I/O1)
NetJ6_1: J6.1 R29.1 U8.6(I/O6)
NetJ6_2: J6.2 R30.1 U8.4(I/O4)
NetJ6_3: J6.3 R31.1 U8.3(I/O3)
NetJ6_4: J6.4 R32.1 U8.1(I/O1)
NetR27_2: R31.2 ; port AOU_UART_RX
NetR29_2: R29.2 ; port ~{MOTOR_ENABLE}
NetR30_2: R30.2 ; port AOU_ERR_IN
NetR32_2: R32.2 ; port AOU_UART_TX

### Notes on the sheet
- (near J6) From AOU through OPU to Tracker Control
- From OPU to main board
- Used to create 5V
- Starts at AOU
- Starts here
- (near J6) 5V common power
- (near J6) GND common
- 24V
- P_GND
- (in symbol Cap 10u 0805) 0805
- (in symbol Cap 100n 0603) 0603

### Library data of the parts
CK26 CK28 = Cap 10u 0805: as CK16 on sheet FDTI_converter_out; JLCPCB Part: C15850; Value: 10u
CK27 CK29 = Cap 100n 0603: as CK5 on sheet main; Value: 100n; JLCPCB Part: C14663
J5 J6 = Pin header 8p_F: 3A Direct Insert Policy 6P -40℃~+105℃ 2.54mm Single Row Black Brass 1x6P Plugin,P=2.54mm Pin Headers ROHS; Manufacturer_Name: Connfly; Manufacturer_Part_Number: DS1021-1*2SF11-B; Datasheet Link: https://www.tme.com/Document/cc301e58a5da78cb543a94b5a5b7f06a/DS1021.pdf; Height: 5.88mm
R29-R36 = Res 100R 0805: as R9 on sheet main; Value: 100R; Package: 0805; Author: JP/27.03.2014; SMD: 1; ComponentLink3Description: rezistor čip; ComponentLink3URL: heliosgreen://v1/hegMT/5-MT/Classes(343)/Folders/OpenForm?RecordNumbers=[381513]; JLCPCB Part: C17408
U8 U9 = USBLC6-4SC6: as U2 on sheet usb_conn; JLCPCB Part: C111212; TME Part: USBLC6-4SC6

## Sheet miscellaneous.SchDoc
size A4; SheetNumber: 7; SheetTotal: 10
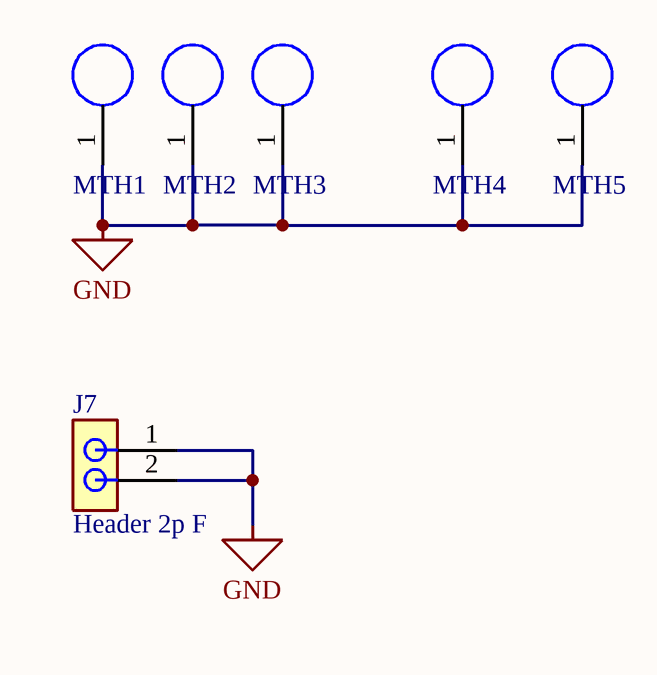
[diagram p6: miscellaneous.SchDoc]

### Parts
J7  Header 2p F  [Pin header 2p - F]
MTH1  Hole  [3.2/6 MM]  (value not drawn)  (no BOM)
MTH2  Hole  [3.2/6 MM]  (value not drawn)  (no BOM)
MTH3  Hole  [3.2/6 MM]  (value not drawn)  (no BOM)
MTH4  Hole  [3.2/6 MM]  (value not drawn)  (no BOM)
MTH5  Hole  [3.2/6 MM]  (value not drawn)  (no BOM)

### Nets
GND: J7.1 J7.2 MTH1.1 MTH2.1 MTH3.1 MTH4.1 MTH5.1

### Library data of the parts
J7 = Pin header 2p_F: Connector; Manufacturer_Name: Connfly; Manufacturer_Part_Number: DS1021-1*2SF11-B; Basic: No; Datasheet Link: https://www.tme.com/Document/cc301e58a5da78cb543a94b5a5b7f06a/DS1021.pdf; Height: 5.88mm
MTH1-MTH5 = Hole: Universal mounting hole plated

## Sheet limit_switches_connector.SchDoc
size A4; SheetNumber: 8; SheetTotal: 10
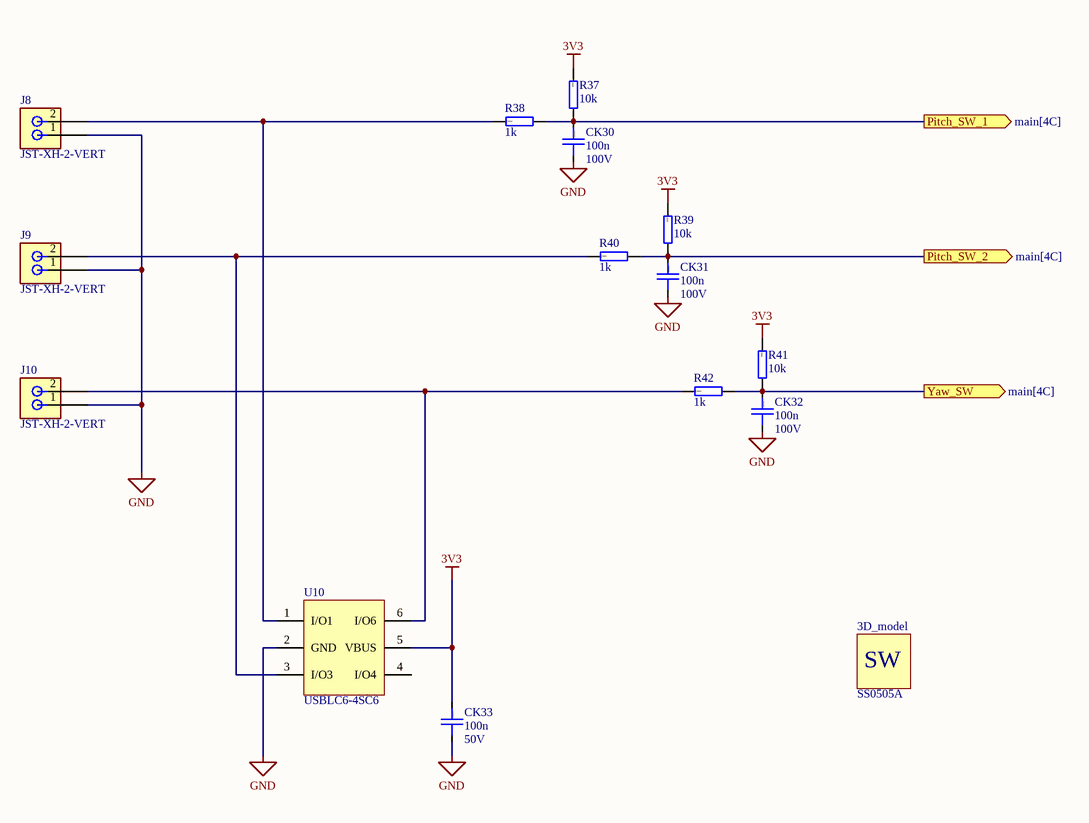
[diagram p7: limit_switches_connector.SchDoc]

### Parts
3D_model  SS0505A  [limit_sw_model]
CK30  100n  Voltage rating: 100V  [CAP0805]
CK31  100n  Voltage rating: 100V  [CAP0805]
CK32  100n  Voltage rating: 100V  [CAP0805]
CK33  100n  Voltage rating: 50V  [CAP0603]
J8  JST-XH-2-VERT  [JST-XH-2p-vert]
J9  JST-XH-2-VERT  [JST-XH-2p-vert]
J10  JST-XH-2-VERT  [JST-XH-2p-vert]
R37  10k  [RESC2012X06N(SMR0805)]
R38  1k  [RESC2012X06N(SMR0805)]
R39  10k  [RESC2012X06N(SMR0805)]
R40  1k  [RESC2012X06N(SMR0805)]
R41  10k  [RESC2012X06N(SMR0805)]
R42  1k  [RESC2012X06N(SMR0805)]
U10  USBLC6-4SC6  [SOT23-6]

### Ports
Pitch_SW_1 (out, see main[4C]), Pitch_SW_2 (out, see main[4C]), Yaw_SW (out, see main[4C])

### Nets
3V3: CK33.1 R37.2 R39.2 R41.2 U10.5(VBUS)
GND: CK30.2 CK31.2 CK32.2 CK33.2 J8.1 J9.1 J10.1 U10.2(GND)
NetCK30_1: CK30.1 R37.1 R38.1 ; port Pitch_SW_1
NetCK31_1: CK31.1 R39.1 R40.1 ; port Pitch_SW_2
NetCK32_1: CK32.1 R41.1 R42.1 ; port Yaw_SW
NetJ8_2: J8.2 R38.2 U10.1(I/O1)
NetJ9_2: J9.2 R40.2 U10.3(I/O3)
NetJ10_2: J10.2 R42.2 U10.6(I/O6)

Not connected (* = marked no-connect by the designer): U10 4(I/O4)

### Notes on the sheet
- (in symbol Cap 100n 100V 0805) 0805
- (in symbol Cap 100n 0603) 0603
- (in symbol model_only_limit_sw) SW

### Library data of the parts
3D_model = model_only_limit_sw: Mikrospínač SNAP ACTION; 3A/250VAC; s páčkou (s kladkou); SPDT; TME Part: WLK-4MINI/HE
CK30-CK32 = Cap 100n 100V 0805: 100V 100nF X7R ±10% 0805 Multilayer Ceramic Capacitors MLCC - SMD/SMT ROHS; Basic: Yes; Value: 100n; JLCPCB Part: C28233
CK33 = Cap 100n 0603: as CK5 on sheet main; Value: 100n; JLCPCB Part: C14663
J8-J10 = JST-XH-2-VERT: Konektor: kabel-pl.spoj; zásuvka; vidlice; PIN: 2; XH; 3A; 250V; THT; Basic: No; TME Part: B2B-XH-A
R37 R39 R41 = Res 10k 0805: as R5 on sheet main; Value: 10k; Package: 0805; SMD: 1; ComponentLink3Description: rezistor čip; ComponentLink3URL: heliosgreen://v1/hegMT/5-MT/Classes(343)/Folders/OpenForm?RecordNumbers=[381513]; JLCPCB Part: C17414
R38 R40 R42 = Res 1k 0805: as R15 on sheet FDTI_converter_out; Value: 1k; Package: 0805; Author: JP/27.03.2014; SMD: 1; ComponentLink3Description: rezistor čip; ComponentLink3URL: heliosgreen://v1/hegMT/5-MT/Classes(343)/Folders/OpenForm?RecordNumbers=[381513]; JLCPCB Part: C17513
U10 = USBLC6-4SC6: as U2 on sheet usb_conn; JLCPCB Part: C111212; TME Part: USBLC6-4SC6

## Sheet misc_connectors.SchDoc
size A4; SheetNumber: 9; SheetTotal: 10
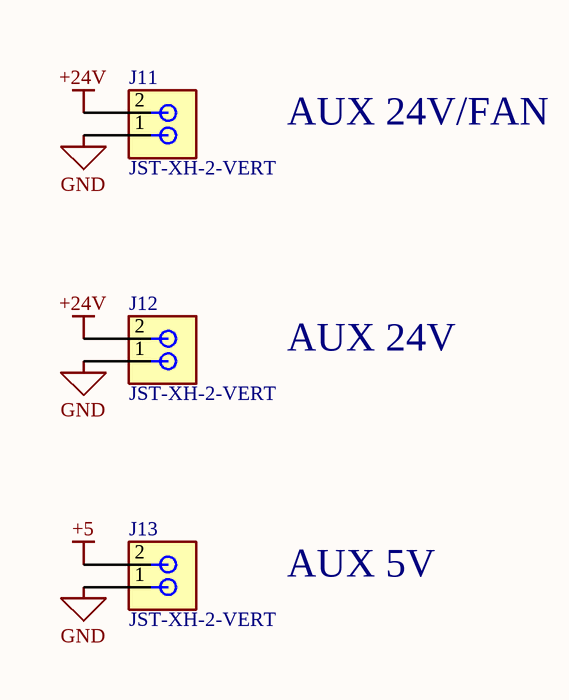
[diagram p8: misc_connectors.SchDoc]

### Parts
J11  JST-XH-2-VERT  [JST-XH-2p-vert]
J12  JST-XH-2-VERT  [JST-XH-2p-vert]
J13  JST-XH-2-VERT  [JST-XH-2p-vert]

### Nets
+5: J13.2
+24V: J11.2 J12.2
GND: J11.1 J12.1 J13.1

### Notes on the sheet
- AUX 24V/FAN
- AUX 24V
- AUX 5V

### Library data of the parts
J11-J13 = JST-XH-2-VERT: as J8 on sheet limit_switches_connector; TME Part: B2B-XH-A

## Sheet debug_leds.SchDoc
size A4; SheetNumber: 10; SheetTotal: 10
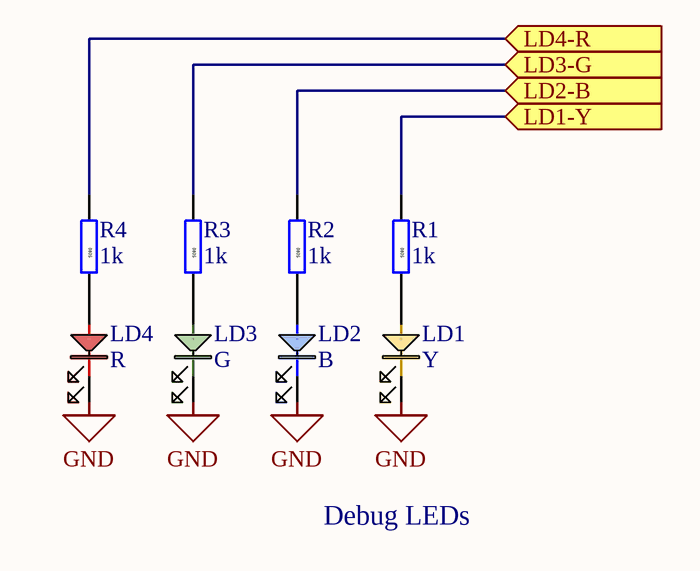
[diagram p9: debug_leds.SchDoc]

### Parts
LD1  Y  [0603_LED_Y]
LD2  B  [0603_LED_B]
LD3  G  [0603_LED_G]
LD4  R  [0603_LED_R]
R1  1k  [RESC2012X06N(SMR0805)]
R2  1k  [RESC2012X06N(SMR0805)]
R3  1k  [RESC2012X06N(SMR0805)]
R4  1k  [RESC2012X06N(SMR0805)]

### Ports
LD1-Y (in), LD2-B (in), LD3-G (in), LD4-R (in)

### Nets
GND: LD1.2 LD2.2 LD3.2 LD4.2
NetLD1_1: LD1.1 R1.2
NetLD2_1: LD2.1 R2.2
NetLD3_1: LD3.1 R3.2
NetLD4_1: LD4.1 R4.2
NetR1_1: R1.1 ; port LD1-Y
NetR2_1: R2.1 ; port LD2-B
NetR3_1: R3.1 ; port LD3-G
NetR4_1: R4.1 ; port LD4-R

### Notes on the sheet
- Debug LEDs

### Library data of the parts
LD1 = LED Y 0603: 0603 Yellow Led; JLCPCB Part: C7496811
LD2 = LED B 0603: 0603 Blue Led; JLCPCB Part: C7496819
LD3 = LED G 0603: 0603 Green Led; JLCPCB Part: C22371297
LD4 = LED R 0603: as LD5 on sheet FDTI_converter_out; JLCPCB Part: C2286
R1-R4 = Res 1k 0805: as R15 on sheet FDTI_converter_out; Value: 1k; Package: 0805; Author: JP/27.03.2014; SMD: 1; ComponentLink3Description: rezistor čip; ComponentLink3URL: heliosgreen://v1/hegMT/5-MT/Classes(343)/Folders/OpenForm?RecordNumbers=[381513]; JLCPCB Part: C17513

## Nets that join several sheets
3V3: main (14 pins), FDTI_converter_out (CK14.1 U3.8), power_supplies (CK24.1 R26.1 U6.2), UART_bus (7 pins), header_conn (CK27.1 CK29.1 U8.2 U9.2), limit_switches_connector (5 pins)
+5: power_supplies (8 pins), header_conn (CK26.1 CK28.1 J5.5 J6.5), misc_connectors (J13.2)
+24V: power_supplies (CK19.1 CK20.1 R17.2 U5.5), header_conn (J6.7), misc_connectors (J11.2 J12.2)
GND: main (23 pins), usb_conn (5 pins), FDTI_converter_out (CK14.2 U3.5), power_supplies (14 pins), UART_bus (CK25.2 U7.7), header_conn (10 pins), miscellaneous (7 pins), limit_switches_connector (8 pins), misc_connectors (J11.1 J12.1 J13.1), debug_leds (LD1.2 LD2.2 LD3.2 LD4.2)
P_GND: power_supplies (NT1.1), header_conn (J6.8)
GPS_UART_RX: main (U1.37), header_conn (R33.2)
GPS_UART_TX: main (U1.38), header_conn (R34.2)
MCU_USART1_RX: main (U1.59), UART_bus (U7.8)
MCU_USART1_TX: main (U1.58), UART_bus (R27.1 R28.1)
MCU_USART2_RX: main (U1.17), FDTI_converter_out (U3.7)
MCU_USART2_TX: main (U1.16), FDTI_converter_out (U3.6)
NetCK30_1: main (U1.10), limit_switches_connector (CK30.1 R37.1 R38.1)
NetCK31_1: main (U1.9), limit_switches_connector (CK31.1 R39.1 R40.1)
NetCK32_1: main (U1.8), limit_switches_connector (CK32.1 R41.1 R42.1)
NetR1_1: main (U1.20), debug_leds (R1.1)
NetR2_1: main (U1.21), debug_leds (R2.1)
NetR3_1: main (U1.22), debug_leds (R3.1)
NetR4_1: main (U1.23), debug_leds (R4.1)
NetR11_1: main (U1.42), usb_conn (R11.1 R12.2)
NetR13_2: main (U1.44), usb_conn (R13.2)
NetR14_2: main (U1.45), usb_conn (R14.2)
NetR27_2: UART_bus (R27.2), header_conn (R31.2)
NetR29_2: main (U1.33), header_conn (R29.2)
NetR30_2: main (U1.34), header_conn (R30.2)
NetR32_2: UART_bus (U7.4), header_conn (R32.2)
OPU_UART_RX: UART_bus (R28.2), header_conn (R35.2)
OPU_UART_TX: UART_bus (U7.5), header_conn (R36.2)